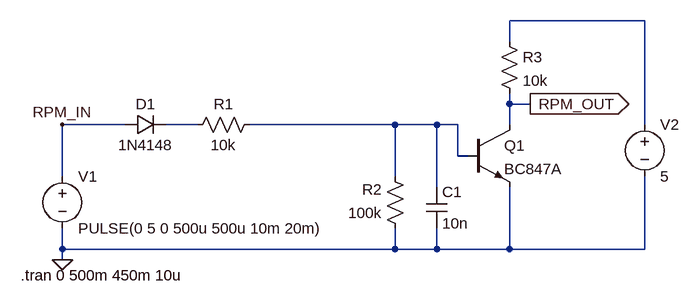
[diagram p0: schematic RPM-filter.asc]
RPM-filter.asc, the LTspice schematic file:
Version 4
SHEET 1 1048 680
WIRE 992 -176 784 -176
WIRE 784 -144 784 -176
WIRE 784 -48 784 -64
WIRE 816 -48 784 -48
WIRE 192 -16 96 -16
WIRE 304 -16 256 -16
WIRE 608 -16 384 -16
WIRE 672 -16 608 -16
WIRE 704 -16 672 -16
WIRE 784 -16 784 -48
WIRE 992 -16 992 -176
WIRE 704 32 704 -16
WIRE 720 32 704 32
WIRE 96 64 96 -16
WIRE 608 64 608 -16
WIRE 672 80 672 -16
WIRE 96 176 96 144
WIRE 608 176 608 144
WIRE 608 176 96 176
WIRE 672 176 672 144
WIRE 672 176 608 176
WIRE 784 176 784 80
WIRE 784 176 672 176
WIRE 992 176 992 64
WIRE 992 176 784 176
WIRE 96 192 96 176
FLAG 96 192 0
FLAG 816 -48 RPM_OUT
IOPIN 816 -48 Out
FLAG 96 -16 RPM_IN
SYMBOL voltage 96 48 R0
WINDOW 123 0 0 Left 0
WINDOW 39 0 0 Left 0
SYMATTR InstName V1
SYMATTR Value PULSE(0 5 0 500u 500u 10m 20m)
SYMBOL res 400 -32 R90
WINDOW 0 0 56 VBottom 2
WINDOW 3 32 56 VTop 2
SYMATTR InstName R1
SYMATTR Value 10k
SYMBOL res 624 160 R180
WINDOW 0 36 76 Left 2
WINDOW 3 36 40 Left 2
SYMATTR InstName R2
SYMATTR Value 100k
SYMBOL cap 656 80 R0
SYMATTR InstName C1
SYMATTR Value 10n
SYMBOL npn 720 -16 R0
SYMATTR InstName Q1
SYMATTR Value BC847A
SYMBOL res 768 -160 R0
SYMATTR InstName R3
SYMATTR Value 10k
SYMBOL voltage 992 -32 R0
WINDOW 123 0 0 Left 0
WINDOW 39 0 0 Left 0
SYMATTR InstName V2
SYMATTR Value 5
SYMBOL diode 192 0 R270
WINDOW 0 32 32 VTop 2
WINDOW 3 0 32 VBottom 2
SYMATTR InstName D1
SYMATTR Value 1N4148
TEXT 32 216 Left 2 !.tran 0 500m 450m 10u

The netlist it stands for:
* RPM-filter.asc
V1 RPM_IN 0 PULSE(0 5 0 500u 500u 10m 20m)
R1 N003 N002 10k
R2 0 N003 100k
C1 N003 0 10n
Q1 RPM_OUT N003 0 0 BC847A
R3 N001 RPM_OUT 10k
V2 N001 0 5
D1 RPM_IN N002 1N4148
.model D D
.lib standard.dio
.model NPN NPN
.model PNP PNP
.lib standard.bjt
.tran 0 500m 450m 10u
.backanno
.end